# EAGLE design ESProgrammer (EAGLE 9.6.2)
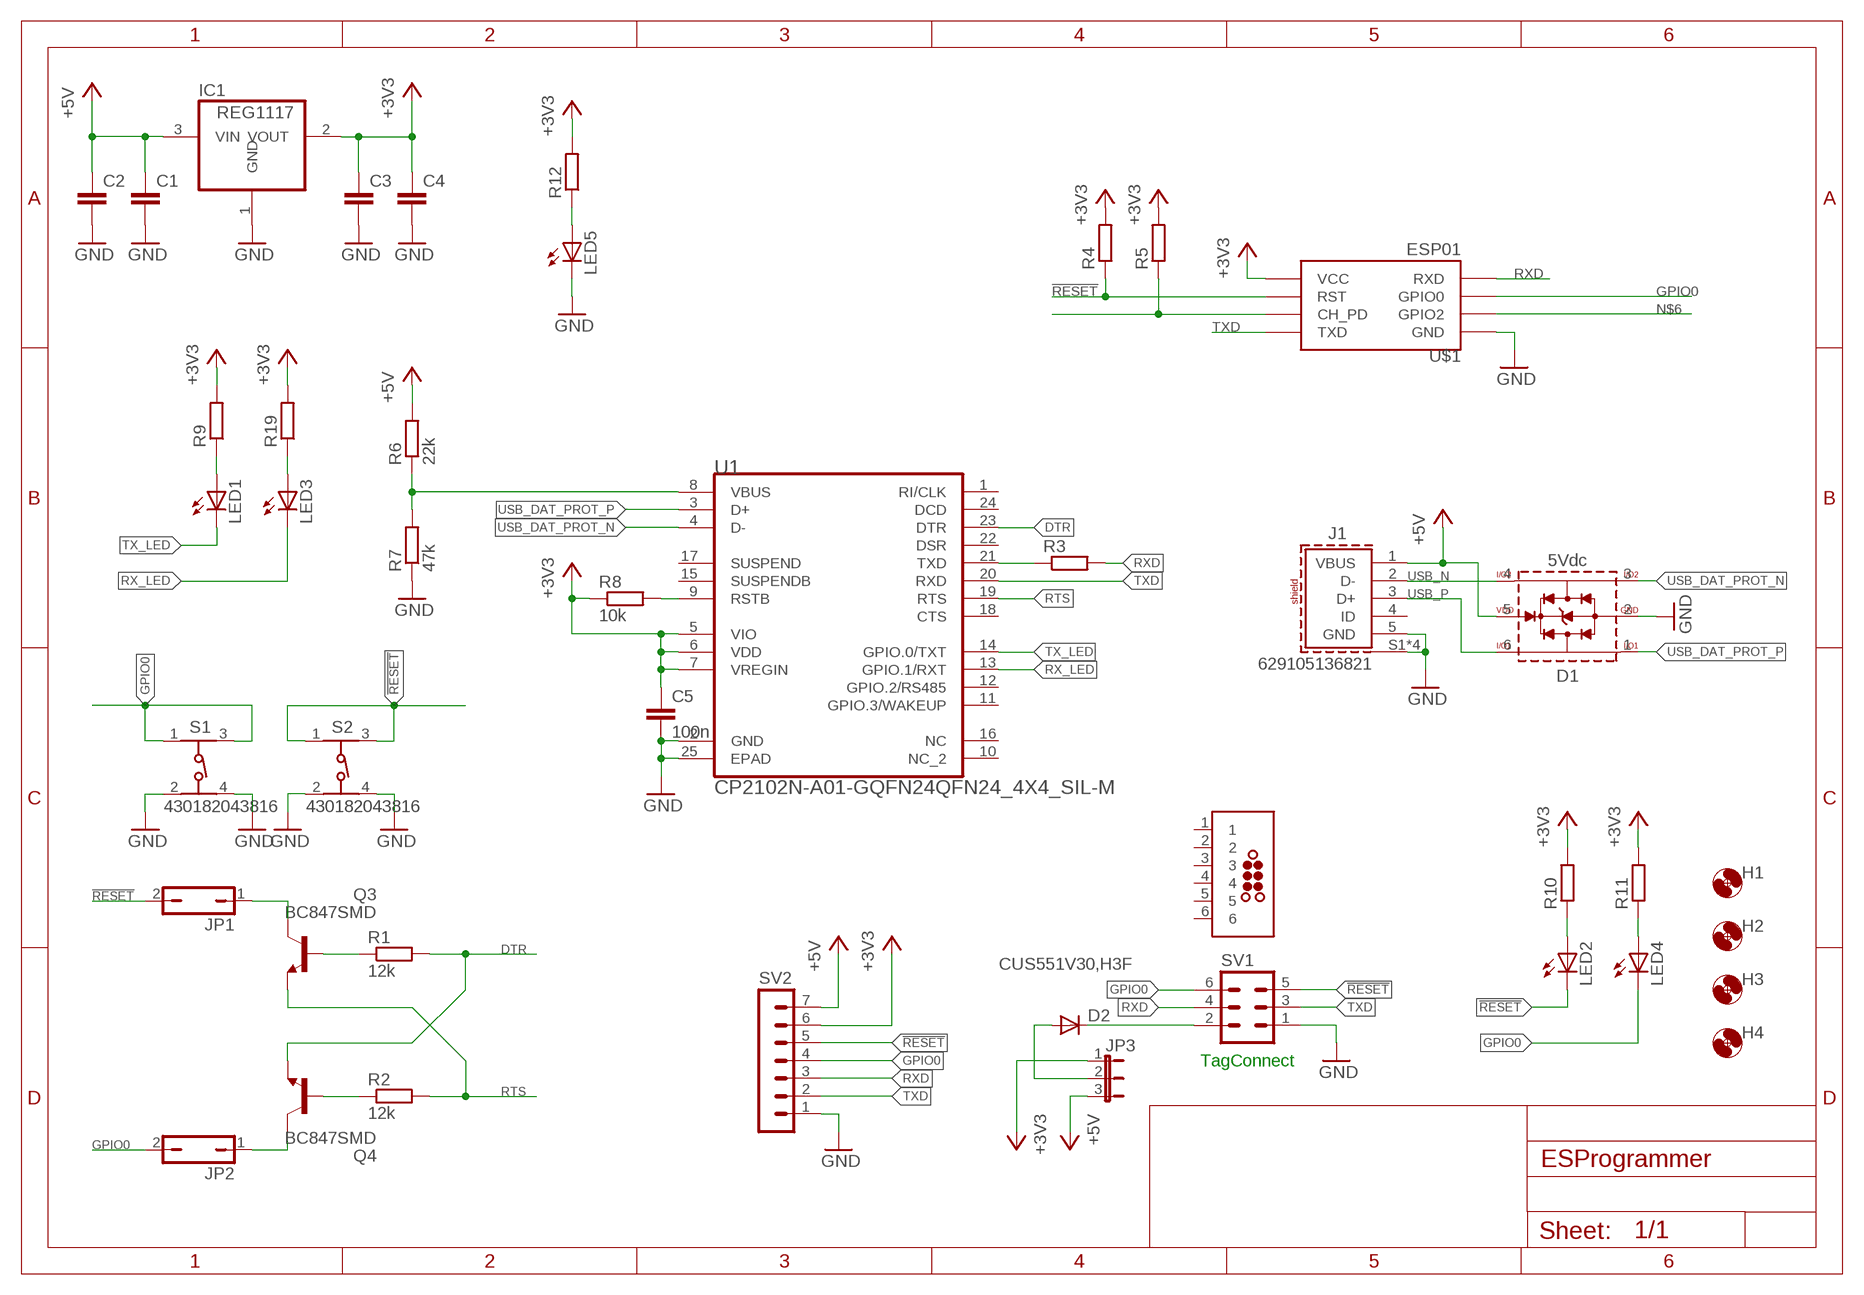
[diagram p0: schematic, sheet 1]

## Parts
C1  C-EUC0603  [C0603]
C2  C-EUC0603  [C0603]
C3  C-EUC0603  [C0603]
C4  C-EUC0603  [C0603]
C5  100n  C-EUC0603  [C0603]
D1  5Vdc  WE-TVS-HS_SOT23-6L_82400102  [WE-TVS_SOT23-6L]
D2  CUS551V30,H3F  DIODE-SOD323-R  [SOD323-R]
H1  MOUNT-HOLE3.2  [3,2]
H2  MOUNT-HOLE3.2  [3,2]
H3  MOUNT-HOLE3.2  [3,2]
H4  MOUNT-HOLE3.2  [3,2]
IC1  REG1117  [SOT223]
J1  629105136821  [629105136821]
J2  TC2030-MCP-NL  [TC2030-MCP-NL]
JP1  JP1Q  [JP1]
JP2  JP1Q  [JP1]
JP3  JP2E  [JP2]
LED1  LEDCHIP-LED0603  [CHIP-LED0603]
LED2  LEDCHIP-LED0603  [CHIP-LED0603]
LED3  LEDCHIP-LED0603  [CHIP-LED0603]
LED4  LEDCHIP-LED0603  [CHIP-LED0603]
LED5  LEDCHIP-LED0603  [CHIP-LED0603]
Q3  BC847SMD  [SOT23]
Q4  BC847SMD  [SOT23]
R1  12k  R-EU_R0603  [R0603]
R2  12k  R-EU_R0603  [R0603]
R3  R-EU_R0603  [R0603]
R4  R-EU_R0603  [R0603]
R5  R-EU_R0603  [R0603]
R6  22k  R-EU_R0603  [R0603]
R7  47k  R-EU_R0603  [R0603]
R8  10k  R-EU_R0603  [R0603]
R9  R-EU_R0603  [R0603]
R10  R-EU_R0603  [R0603]
R11  R-EU_R0603  [R0603]
R12  R-EU_R0603  [R0603]
R19  R-EU_R0603  [R0603]
S1  430182043816  [430182043816]
S2  430182043816  [430182043816]
SV1  ML6  [ML6]
SV2  MA07-1  [MA07-1]
U1  CP2102N-A01-GQFN24QFN24_4X4_SIL-M  [QFN24_4X4_SIL-M]
U$1  ESP01  [ESP01]

## Nets
!RESET: JP1.2 LED2.C R4.1 S2.1 S2.3 SV1.5 SV2.5 U$1.RST
+3V3: C3.1 C4.1 C5.1 IC1.2(VOUT) JP3.1 R4.2 R5.2 R8.1 R9.2 R10.2 R11.2 R12.2 R19.2 SV2.6 U1.5(VIO) U1.6(VDD) U1.7(VREGIN) U$1.VCC
+5V: C1.1 C2.1 D1.5(VDD) IC1.3(VIN) J1.1(VBUS) JP3.3 R6.2 SV2.7
DTR: Q4.2(E) R1.2 U1.23(DTR)
GND: C1.2 C2.2 C3.2 C4.2 C5.2 D1.2(GND) IC1.1(GND) J1.5(GND) J1.S1(SHIELD) J1.S2(SHIELD) J1.S3(SHIELD) J1.S4(SHIELD) LED5.C R7.1 S1.2 S1.4 S2.2 S2.4 SV1.1 SV2.1 U1.2(GND) U1.25(EPAD) U$1.GND
GPIO0: JP2.2 LED4.C S1.1 S1.3 SV1.6 SV2.4 U$1.GPIO0
N$1: Q3.1(B) R1.1
N$2: Q4.1(B) R2.1
N$3: JP1.1 Q3.3(C)
N$4: JP2.1 Q4.3(C)
N$5: R3.1 U1.21(TXD)
N$6: U$1.GPIO2
N$7: R5.1 U$1.CH_PD
N$8: LED1.A R9.1
N$9: LED2.A R10.1
N$10: R6.1 R7.2 U1.8(VBUS)
N$11: R8.2 U1.9(RSTB)
N$12: LED4.A R11.1
N$13: LED5.A R12.1
N$14: D2.A JP3.2
N$15: D2.C SV1.2
N$19: LED3.A R19.1
RTS: Q3.2(E) R2.2 U1.19(RTS)
RX_LED: LED3.C U1.13(GPIO.1/RXT)
RXD: R3.2 SV1.4 SV2.3 U$1.RX(RXD)
TX_LED: LED1.C U1.14(GPIO.0/TXT)
TXD: SV1.3 SV2.2 U1.20(RXD) U$1.TX(TXD)
USB_DAT_PROT_N: D1.3(I/O2) U1.4(D-)
USB_DAT_PROT_P: D1.1(I/O1) U1.3(D+)
USB_N: D1.4(I/O4) J1.2(D-)
USB_P: D1.6(I/O3) J1.3(D+)
Unconnected: J1.4(ID) J2.1 J2.4 J2.5 J2.6 U1.1(RI/CLK) U1.10(NC_2) U1.11(GPIO.3/WAKEUP) U1.12(GPIO.2/RS485) U1.15(SUSPENDB) U1.16(NC) U1.17(SUSPEND) U1.18(CTS) U1.22(DSR) U1.24(DCD)

## Notes on the sheet
- TagConnect

## Power pins joined to a net without a drawn wire
2: J2.2
3: J2.3

## Library data of the parts
C1-C5 = rcl:C-EU: CAPACITOR, European symbol
D1 = Wurth_EMC Components_WE-TVS:WE-TVS-HS_SOT23-6L_82400102: WE-TVS TVS Diode – High Speed Series Characteristics Low clamping voltage Sturdy design Very low capacitance Flow Thru Design for a simple layout Rail to Rail protection Epoxy flame resistant UL94-V0 RoHS, REACH and free of halogens Applications Very fast data lines USB 2.0 Ethernet PoE VGA Sim Cards Keypads HS = High Speed <https://www.we-online.com/catalog/media/o14883v209%20Family_WE-TVS_HIGHSPEED.jpg> Details see: https://www.we-online.com/catalog/en/WE-TVS-HS Updated by Ella Wu 2021-12-16 2021(C) Wurth Elektronik; C-CH: 2pF; CHANNELS: 2+1; DATASHEET-URL: https://www.we-online.com/catalog/datasheet/82400102.pdf; IPEAK: 7A; MOUNT: SMT; PART-NUMBER: 82400102; VBR: 6V
D2 = diode:DIODE-: DIODE
H1-H4 = holes:MOUNT-HOLE: MOUNTING HOLE with drill center marker
IC1 = burr-brown:REG1117: 800mA and 1A Low Dropout (LDO) Positive Regulator 1.8V, 2.5V, 2.85V, 3.3V, 5V, and Adj; MPN: REG1117; OC_FARNELL: 1097566; OC_NEWARK: 14P6981
J1 = Eagle_WR-USB (rev21f):629105136821: WR-COM Micro USB 2.0 SMT Type B Horizontal 5 Contacts Kind Properties Durability:10 000 Mating cycles Quality Class:10 000 Mating cycles Connector Type:Micro USB Gender:Receptacle Type:Horizontal General Information Operating Temperature:-40up to +105 °C Compliance:RoHS Electrical Properties IR 1:1A Working Voltage:30V (AC) Withstanding Voltage:100V (AC) Contact Resistance:30 mΩ Material Properties Insulator Material:LCP Insulator Flammability Rating:UL94 V-0 Color:Black Contact Material:Copper Alloy Contact Plating: Gold Contact Type:Stamped Shielding Material:Stainless Steel Shielding Plating:Nickel <https://www.we-online.com/catalog/media/o32999v209%20Family_WR-COM_629105136821.jpg> Details see: https://www.we-online.com/catalog/en/COM_MICRO_SMT_TYPE_B_HORIZONTAL/ Updated by Yingchun, Shan 2020-01-16 2020 (C) Würth Elektronik; APPLICATION: Micro USB 2.0; DATASHEET-URL: https://www.we-online.com/catalog/datasheet/629105136821.pdf; GERDER: Receptacle; INTERFACE-TYPE: Type B; IR1: 1.0A; MOUNT: SMT; PACKAGING: Tape and Reel; PART-NUMBER: 629105136821; PINS: 5; TYPE: Horizontal; WORKING-VOLTAGE: 30V(AC)
J2 = tag-connect:TC2030: TAG-CONNECT ICSP Connector Manufacturer: Tag-Connect <http://www.tag-connect.com> Cable for easy In-Circuit Serial Programming. Designed for Microchip ICD2, suitable for many others. Two variants - one "with legs" (for hands-free fit on PCB) and another "without legs" for quick programming. PAD Description 1 MCLR/Vpp 2 Vdd 3 GND 4 PGD (ISPDAT) 5 PGC (ISPCLK) 6 nc (used for LVP) ©2009 ROFA.cz - modified and updated by Robert Darlington ‹rdarlington@gmail.com›
JP1 JP2 = jumper:JP1Q: JUMPER
JP3 = jumper:JP2E: JUMPER
LED1-LED5 = led:LED: LED OSRAM: - CHIPLED LG R971, LG N971, LY N971, LG Q971, LY Q971, LO R971, LY R971 LH N974, LH R974 LS Q976, LO Q976, LY Q976 LO Q996 - Hyper CHIPLED LW Q18S LB Q993, LB Q99A, LB R99A - SideLED LS A670, LO A670, LY A670, LG A670, LP A670 LB A673, LV A673, LT A673, LW A673 LH A674 LY A675 LS A676, LA A676, LO A676, LY A676, LW A676 LS A679, LY A679, LG A679 - Hyper Micro SIDELED® LS Y876, LA Y876, LO Y876, LY Y876 LT Y87S - SmartLED LW L88C, LW L88S LB L89C, LB L89S, LG L890 LS L89K, LO L89K, LY L89K LS L896, LA L896, LO L896, LY L896 - TOPLED LS T670, LO T670, LY T670, LG T670, LP T670 LSG T670, LSP T670, LSY T670, LOP T670, LYG T670 LG T671, LOG T671, LSG T671 LB T673, LV T673, LT T673, LW T673 LH T674 LS T676, LA T676, LO T676, LY T676, LB T676, LH T676, LSB T676, LW T676 LB T67C, LV T67C, LT T67C, LS T67K, LO T67K, LY T67K, LW E67C LS E67B, LA E67B, LO E67B, LY E67B, LB E67C, LV E67C, LT E67C LW T67C LS T679, LY T679, LG T679 LS T770, LO T770, LY T770, LG T770, LP T770 LB T773, LV T773, LT T773, LW T773 LH T774 LS E675, LA E675, LY E675, LS T675 LS T776, LA T776, LO T776, LY T776, LB T776 LHGB T686 LT T68C, LB T68C - Hyper Mini TOPLED® LB M676 - Mini TOPLED Santana® LG M470 LS M47K, LO M47K, LY M47K Source: http://www.osram.convergy.de LUXEON: - LUMILED® LXK2-PW12-R00, LXK2-PW12-S00, LXK2-PW14-U00, LXK2-PW14-V00 LXK2-PM12-R00, LXK2-PM12-S00, LXK2-PM14-U00 LXK2-PE12-Q00, LXK2-PE12-R00, LXK2-PE12-S00, LXK2-PE14-T00, LXK2-PE14-U00 LXK2-PB12-K00, LXK2-PB12-L00, LXK2-PB12-M00, LXK2-PB14-N00, LXK2-PB14-P00, LXK2-PB14-Q00 LXK2-PR12-L00, LXK2-PR12-M00, LXK2-PR14-Q00, LXK2-PR14-R00 LXK2-PD12-Q00, LXK2-PD12-R00, LXK2-PD12-S00 LXK2-PH12-R00, LXK2-PH12-S00 LXK2-PL12-P00, LXK2-PL12-Q00, LXK2-PL12-R00 Source: www.luxeon.com KINGBRIGHT: KA-3528ASYC Source: www.kingbright.com
Q3 Q4 = transistor-npn:BC847*: NPN Transistor
R1-R12 R19 = rcl:R-EU_: RESISTOR, European symbol
S1 S2 = Wurth_Switch_WS-TASV:430182043816: WS-TASV SMT Tact Switch 6x6 mm Material Properties Cover Material : Stainless Steel Properties Actuator Material:LCP Actuator Flammability :UL94 V-0 Rating Actuator Color:Black; Salmon; White Frame Material:LCP Flammability Rating:UL94 V-0 Frame Color:Black Contact Material:Stainless Steel Contact Plating:Silver Terminal Material:Copper Alloy Terminal Plating:Silver VR:12 V (DC) Contact Resistance Initial:100 mΩ Contact Resistance After Life Test:2Ω RISO:100 MΩ Withstanding Voltage:250 V (AC) Washable:No Qty.:4000;5000 Mechanical Properties Electrical Life:400; 550; 1000 Stroke :0.25 mm General Information Operating Temperature:-40 up to +85 °C Washable:No Packaging Properties Packaging:Tape and Reel <https://www.we-online.com/catalog/media/o37470v209%20Family_WS-TASV_6x6mm_SMD_Tact_Switch_4301820xx8xx.jpg> Details see: https://www.we-online.com/catalog/en/TASV_6X6_SMD/ Updated by yingchun,Shan;2020-02-18 2020(C) Würth Elektronik; DATASHEET-URL: https://www.we-online.com/catalog/datasheet/430182043816.pdf; H: 4.3mm; OPERATION-FORCE: 160g; PART-NUMBER: 430182043816; QTY: 1000
SV1 = con-harting-ml:ML6: HARTING; OC_FARNELL: unknown; OC_NEWARK: unknown
SV2 = con-lstb:MA07-1: PIN HEADER; OC_FARNELL: unknown; OC_NEWARK: unknown
U1 = Eigene-Rietig:CP2102N-A01-GQFN24; COPYRIGHT: Copyright (C) 2021 Ultra Librarian. All rights reserved.; MANUFACTURER_PART_NUMBER: CP2102N-A01-GQFN24; MFR_NAME: Silicon Labs
U$1 = esp8266modules:ESP01: ESP8266 Wifi module 01

## Board
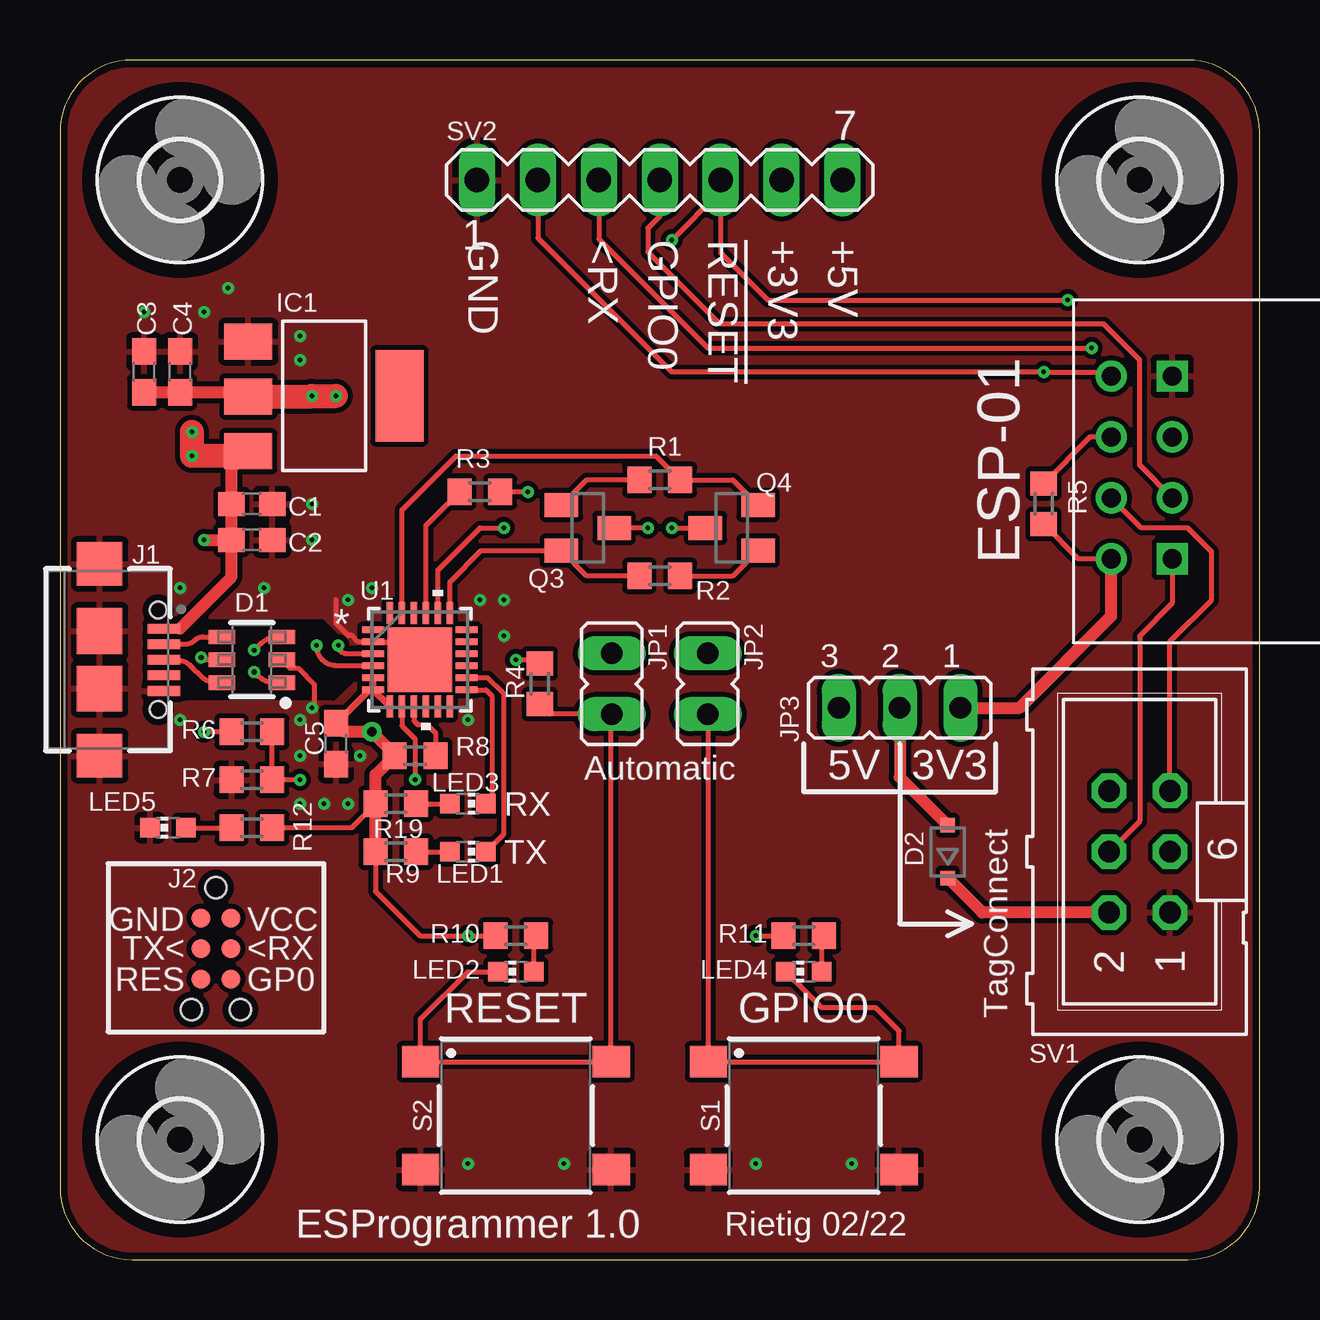
[diagram p1: board, top side]
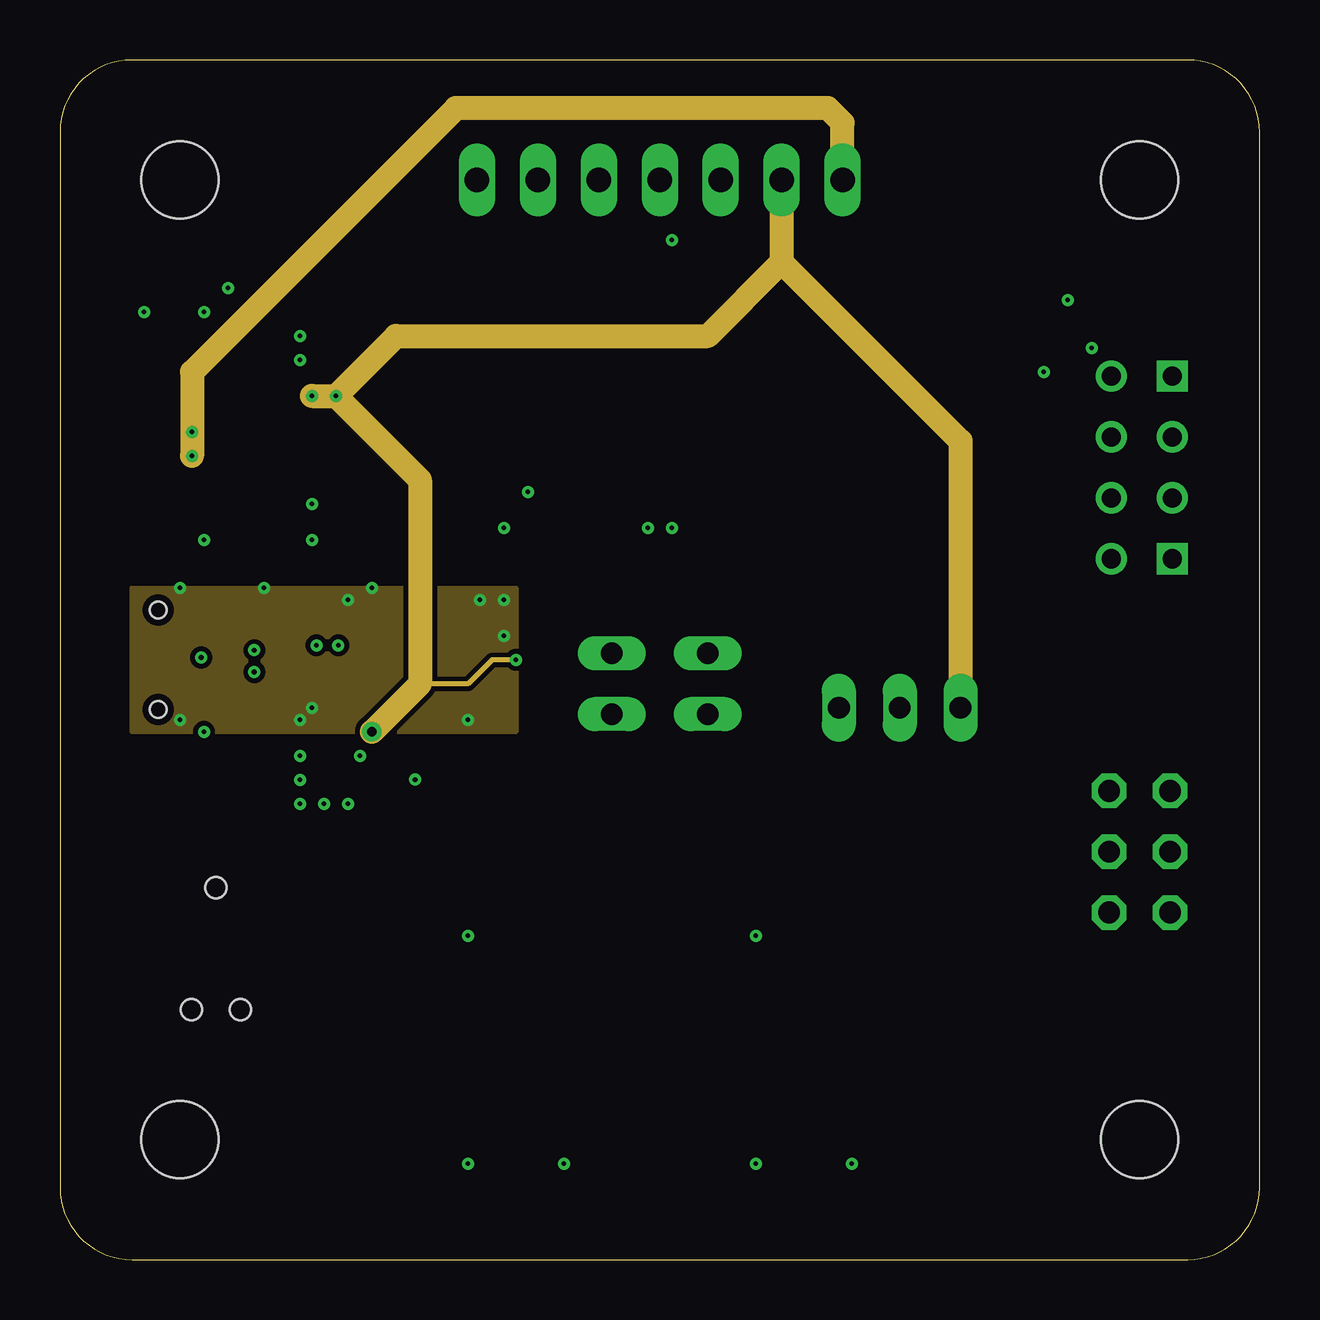
[diagram p2: board, inner layer Route2]
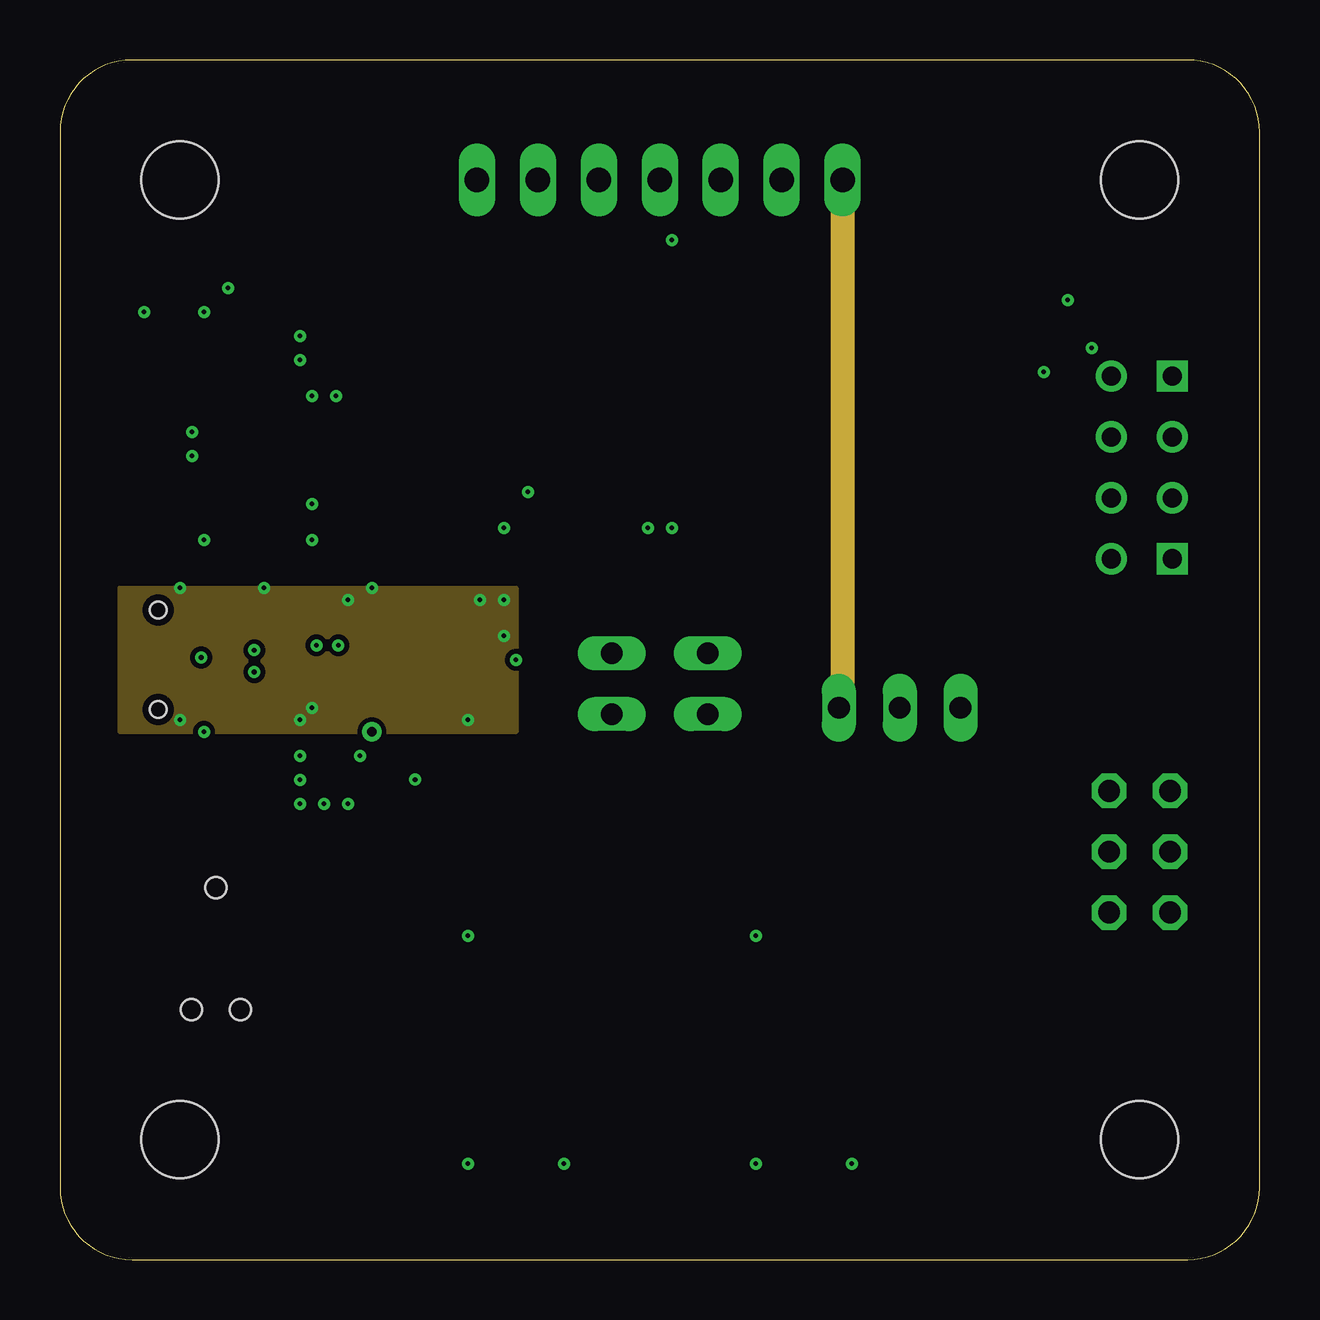
[diagram p3: board, inner layer Route15]
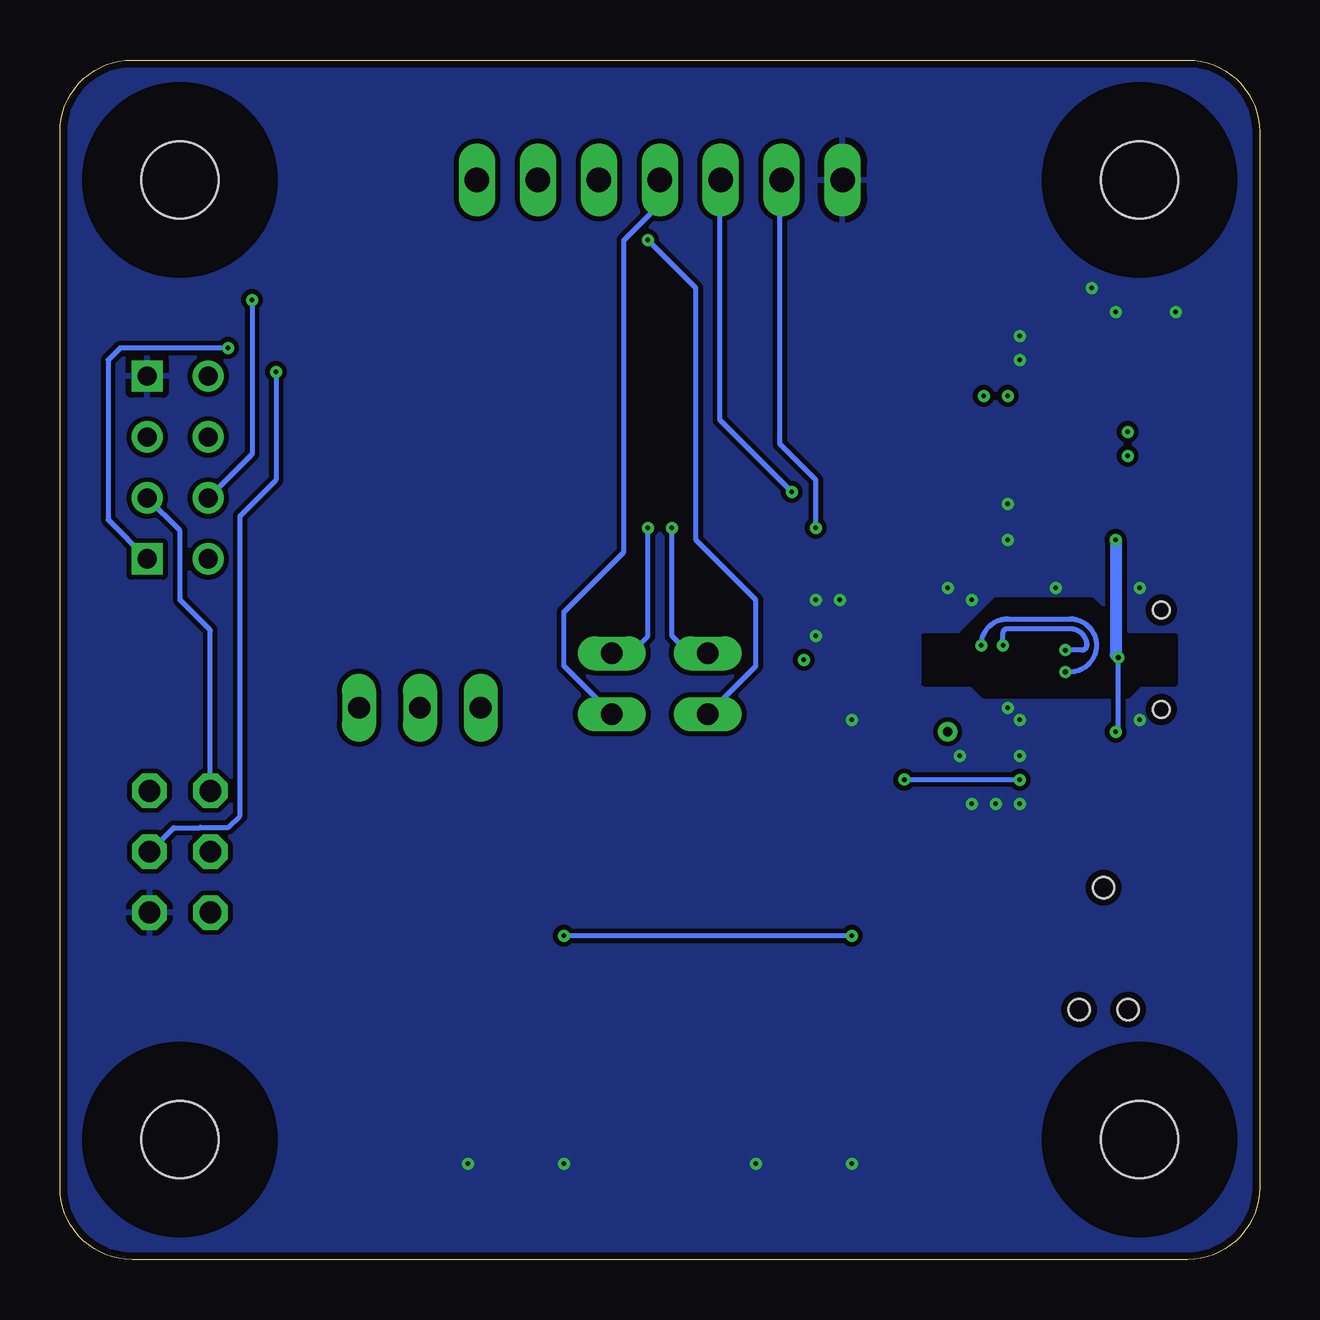
[diagram p4: board, bottom side, seen from below]

Size 50 x 50 mm. Coordinates in mm from the lower left corner, seen from the top.
Outline: 0,47 0,3 arc90 3,0 47,0 arc90 50,3 50,47 arc90 47,50 3,50 arc90 0,47
Copper layers (1+2*15+16): Top 0.035mm / dielectric 0.2mm / Route2 0.0175mm / dielectric 1.065mm / Route15 0.0175mm / dielectric 0.2mm / Bottom 0.035mm
Design rules "jlcpcb-4layers_seb *": minimum track width 0.2mm, minimum drill 0.2mm, track to track 8mil, track to pad 8mil, pad to pad 8mil, via to via 8mil, smd to smd 8mil, copper to edge 0.3mm, drill to drill 8mil, minimum pad ring 10mil, minimum via ring 0.15mm, stop-mask expansion 2mil, vias tented up to drill 20mil, thermal gap 10mil

### Footprints (pad centres in the part's own frame; a part is rotated, then mirrored left to right if it is on the bottom)
C0603 = smd 1.1 x 1: 1 -0.85,0; 2 0.85,0
WE-TVS_SOT23-6L = smd 0.6 x 1.1: 1 -0.95,-1.25; 2 0,-1.25; 3 0.95,-1.25; 4 0.95,1.25; 5 0,1.25; 6 -0.95,1.25
SOD323-R = smd 0.6 x 0.6: A 1.1,0; C -1.1,0
3,2 = hole 3.2: 0,0
SOT223 = smd 1.499 x 2.007: 1 -2.261,-3.15; 2 0.025,-3.15; 3 2.311,-3.15 | smd 3.81 x 2.007: 4 0,3.15
629105136821 = smd 0.4 x 1.35: 1 -1.3,2.325; 2 -0.65,2.325; 3 0,2.325; 4 0.65,2.325; 5 1.3,2.325 | smd 1.8 x 1.9: S1 -4,-0.35; S4 4,-0.35 | smd 1.9 x 1.9: S2 -1.2,-0.35; S3 1.2,-0.35 | hole 0.7: -2.075,2.1; 2.075,2.1
TC2030-MCP-NL = smd 0.787 x 0.787: 1 1.27,-0.635; 2 1.27,0.635; 3 2.54,-0.635; 4 2.54,0.635; 5 3.81,-0.635; 6 3.81,0.635 | hole 0.889: 0,0; 5.08,-1.016; 5.08,1.016
JP1 = drill 0.914 long: 1 0,-1.27; 2 0,1.27
JP2 = drill 0.914 long: 1 -2.54,0; 2 0,0; 3 2.54,0
CHIP-LED0603 = smd 0.8 x 0.8: A 0,-0.75; C 0,0.75
SOT23 = smd 1 x 1.4: 1 -0.95,-1.1; 2 0.95,-1.1; 3 0,1.1
R0603 = smd 1 x 1.1: 1 -0.85,0; 2 0.85,0
430182043816 = smd 1.55 x 1.3: 1 -3.975,2.25; 2 -3.975,-2.25; 3 3.975,2.25; 4 3.975,-2.25
ML6 = drill 0.914 octagon: 1 -2.54,-1.27; 2 -2.54,1.27; 3 0,-1.27; 4 0,1.27; 5 2.54,-1.27; 6 2.54,1.27
MA07-1 = drill 1.016 long: 1 -7.62,0; 2 -5.08,0; 3 -2.54,0; 4 0,0; 5 2.54,0; 6 5.08,0; 7 7.62,0
QFN24_4X4_SIL-M = smd 0.914 x 0.254: 1 -1.943,1.25; 2 -1.943,0.75; 3 -1.943,0.25; 4 -1.943,-0.25; 5 -1.943,-0.75; 6 -1.943,-1.25; 13 1.943,-1.25; 14 1.943,-0.75; 15 1.943,-0.25; 16 1.943,0.25; 17 1.943,0.75; 18 1.943,1.25 | smd 0.254 x 0.914: 7 -1.25,-1.943; 8 -0.75,-1.943; 9 -0.25,-1.943; 10 0.25,-1.943; 11 0.75,-1.943; 12 1.25,-1.943; 19 1.25,1.943; 20 0.75,1.943; 21 0.25,1.943; 22 -0.25,1.943; 23 -0.75,1.943; 24 -1.25,1.943 | smd 2.692 x 2.692: 25 0,0
ESP01 = drill 0.8: CH_PD -1.285,-8.178; GPIO0 1.255,-5.638; GPIO2 -1.285,-5.638; RST 1.255,-8.178; TX -3.825,-8.178; VCC 3.795,-8.178 | drill 0.8 square: GND -3.825,-5.638; RX 3.795,-5.638

### Placement (x,y rotation side)
C1  8,31.5 0 top
C2  8,30 0 top
C3  3.5,37 90 top
C4  5,37 90 top
C5  11.5,21.5 270 top
D1  8,25 90 top
D2  37,17 90 top
H1  5,5 0 top
H2  45,5 0 top
H3  45,45 0 top
H4  5,45 0 top
IC1  11,36 270 top
J1  2,25 270 top
J2  6.5,15.5 270 top
JP1  23,24 180 top
JP2  27,24 180 top
JP3  35,23 180 top
LED1  17,17 270 top
LED2  19,12 90 top
LED3  17,19 270 top
LED4  31,12 90 top
LED5  4.5,18 90 top
Q3  22,30.5 270 top
Q4  28,30.5 90 top
R1  25,32.5 0 top
R2  25,28.5 180 top
R3  17.5,32 0 top
R4  20,24 90 top
R5  41,31.5 270 top
R6  8,22 180 top
R7  8,20 0 top
R8  14.8,21 0 top
R9  14,17 180 top
R10  19,13.5 180 top
R11  31,13.5 180 top
R12  8,18 0 top
R19  14,19 180 top
S1  31,6 0 top
S2  19,6 0 top
SV1  45,17 90 top
SV2  25,45 0 top
U1  15,25 0 top
U$1  52,33 270 top

### Tracks (layer width: path | path; a pad name or v marks a point on that pad's centre or on a via)
!RESET  (via drill 0.2 pad 0.4)
  Top 0.2: R4.1 20.42,22.73 JP1.2 22.98,22.7 S2.3 S2.1 15.03,10.03 17,12 LED2.C | v25.5,42.5 27.54,44.54 SV2.5 27.54,41.96 29.5,40 v42,40 | SV1.5 46.27,25.77 48,27.5 48,29.5 47,30.5 45.07,30.5 U$1.RST
  Bottom 0.2: JP1.2 21,24.73 21,27.5 23.5,30 23.5,40.5 v25.5,42.5 | v42,40 42,33.57 U$1.RST
+3V3  (via drill 0.2 pad 0.4, 0.2 pad 0.5, 0.4 pad 0.8)
  Top 0.2: U$1.VCC 42.45,29.2 R5.2 | R9.2 13.15,15.35 15,13.5 v17,13.5 R10.2 | v29,13.5 R11.2 | R4.2 19.85,25 v19,25 | R12.2 12.15,18 R19.2
  Top 0.3: C5.1 12.9,23.75 U1.6 | U1.6 U1.5 | U1.7 U1.6
  Top 0.5: C3.1 C4.1 7.67,36.15 IC1.2 | JP3.1 40,23 43.82,26.82 U$1.VCC | C5.1 11.85,22 v13,22 13.95,21.05 R8.1 13.15,20.2 R19.2 R9.2
  Top 1: IC1.2 10.47,35.98 v10.5,36 v11.5,36
  Route2 0.2: v19,25 18,25 17,24 15,24
  Route2 1: v11.5,36 14,38.5 27,38.5 30.08,41.58 | SV2.6 30.08,41.58 | 30.08,41.58 37.54,34.12 JP3.1 | v11.5,36 15,32.5 15,24 v13,22 | v10.5,36 v11.5,36
  Bottom 0.2: v17,13.5 v29,13.5
+5V  (via drill 0.2 pad 0.5)
  Top 0.2: D1.5 5.98,25 v5.89,25.1 | R6.2 v6,22 | J1.1 5,26.3
  Top 0.5: C2.1 7.15,28.45 5,26.3 | C2.1 C1.1 7.15,32.99 IC1.3 | v6,30 C2.1
  Top 1: IC1.3 7.66,33.5 v5.5,33.5 v5.5,34.5
  Route2 1: SV2.7 32.62,47.38 32,48 16.5,48 5.5,37 v5.5,33.5
  Route15 1: SV2.7 32.62,23.16 JP3.3
  Bottom 0.2: v6,22 5.89,22.11 v5.89,25.1
  Bottom 0.5: v6,30 6,25.21 v5.89,25.1
DTR
  Top 0.2: Q4.2 28.05,32.5 R1.2 24.85,33.5 16.5,33.5 14.25,31.25 U1.23
GND  (via drill 0.2 pad 0.5)
  Top 0.2: U1.25 14.25,25.75 U1.2 12.43,25.75 12.18,26 12,26 11.5,26.5 11.5,27.5 | D1.2 9.6,24.65 9.93,24.65 10.6,23.98 10.6,23.1 v10.5,23
  other vias: 13,28 8.5,28 5,28 5,22.5 10,22.5 12,27.5 17.5,27.5 17,22.5 18.5,27.5 10.5,31.5 10.5,30 10,38.5 10,37.5 7,40.5 6,39.5 3.5,39.5 17,4 21,4 29,4 33,4 10,21 12.5,21 11,19 10,19 12,19 18.5,26
  pour Bottom: 47,0 3,0 arc-90 0,3 0,47 arc-90 3,50 47,50 arc-90 50,47 50,3 arc-90
  pour Top: 47,0 3,0 arc-90 0,3 0,47 arc-90 3,50 47,50 arc-90 50,47 50,3 arc-90
  cutout Top (isolate 0.8, no thermals): 13.3,24.5 12.5,24.5 11.4,23.4 5.3,23.4 4.3,24.4 4.3,25.6 5.3,26.6 10.9,26.6 12,25.5 13.3,25.5
  pour Route2: 3,28 19,28 19,22 3,22
  pour Route15: 3,28 19,28 19,22 3,22
  cutout Bottom: 3.5,26 5.5,26 6.5,27 7,27.5 11,27.5 12.5,26 14,26 14,24 12,24 11.5,23.5 5.5,23.5 5,24 3.5,24
  pour Route15: 2.5,28 17.5,28 17.5,22 2.5,22
GPIO0
  Top 0.2: JP2.2 27.02,22.7 S1.1 S1.3 34.98,9.53 34,10.5 31.75,10.5 LED4.C | SV2.4 25,43.5 24.5,43 24.5,42 27.5,39 43.5,39 45,37.5 45,33.11 U$1.GPIO0
  Bottom 0.2: JP2.2 29,24.73 29,27 26.5,29.5 26.5,42.5 25,44 SV2.4 | SV1.6 43.73,26.23 45,27.5 45,30.38 U$1.GPIO0
N$1
  Top 0.2: R1.1 21.95,32.5 Q3.1
N$2
  Top 0.2: R2.1 28.05,28.5 Q4.1
N$3  (via drill 0.2 pad 0.4)
  Top 0.2: v24.5,30.5 Q3.3
  Bottom 0.2: JP1.1 23.77,25.27 24.5,26 v24.5,30.5
N$4  (via drill 0.2 pad 0.5)
  Top 0.2: v25.5,30.5 Q4.3
  Bottom 0.2: JP2.1 26.23,25.27 25.5,26 v25.5,30.5
N$5
  Top 0.2: U1.21 15.25,30.6 R3.1
N$7
  Top 0.2: U$1.CH_PD 42.94,34.28 R5.1
N$8
  Top 0.2: R9.1 LED1.A
N$9
  Top 0.2: LED2.A 19.75,13.4 R10.1
N$10  (via drill 0.2 pad 0.5)
  Top 0.2: v10,20 R7.2 R6.1 | U1.8 14.25,22.25 14.8,21.7 v14.8,20
  Bottom 0.2: v14.8,20 v10,20
N$11
  Top 0.2: U1.9 14.75,22.45 14.9,22.3 15.3,22.3 15.65,21.95 R8.2
N$12
  Top 0.2: LED4.A 31.75,13.4 R11.1
N$13
  Top 0.2: LED5.A 7.11,18 7.13,17.98 R12.1
N$14
  Top 0.5: JP3.2 35,20.1 D2.A
N$15
  Top 0.5: SV1.2 38.44,14.46 D2.C
N$19
  Top 0.2: R19.1 LED3.A
RTS
  Top 0.2: R2.2 21.95,28.5 Q3.2 17.55,29.55 16.25,28.25 U1.19
RX_LED
  Top 0.2: U1.13 17.75,23.75 18,23.5 18,19.25 LED3.C
RXD  (via drill 0.2 pad 0.4)
  Top 0.2: v19.5,32 R3.2 | SV2.3 22.46,42.54 27,38 v43,38 | U$1.RX 46.36,27.36 45,26 45,18.27 SV1.4
  Bottom 0.2: v19.5,32 22.5,35 22.5,44.96 SV2.3 | v43,38 47.5,38 48,37.5 48,30.84 U$1.RX
TX_LED
  Top 0.2: U1.14 17.82,24.25 18.5,23.57 18.5,17.75 LED1.C
TXD  (via drill 0.2 pad 0.5)
  Top 0.2: U1.20 15.75,28.75 17.5,30.5 v18.5,30.5 | SV2.2 19.92,42.58 25.5,37 v41,37 43.65,37 U$1.TX
  Bottom 0.2: v18.5,30.5 18.5,32.5 20,34 20,44.92 SV2.2 | SV1.3 45.27,18 44.16,18 44.15,18.01 42.99,18.01 42.5,18.5 42.5,31 41,32.5 v41,37
USB_DAT_PROT_N  (via drill 0.2 pad 0.5)
  Top 0.2: v10.69,25.6 arc90 11.54,24.75 U1.4 | D1.3 9.06,25.95 arc45 8.36,25.66 v8.1,25.4
  Bottom 0.2: v10.69,25.6 10.69,26.11 arc90 10.5,26.3 7.9,26.3 arc90 7.2,25.6 arc90 7.4,25.4 v8.1,25.4
USB_DAT_PROT_P  (via drill 0.2 pad 0.5)
  Top 0.2: v11.6,25.6 arc90 11.95,25.25 U1.3 | v8.1,24.49 8.25,24.34 arc45 8.96,24.05 D1.1
  Bottom 0.2: v11.6,25.6 v11.6,25.6 arc90 10.5,26.7 7.9,26.7 arc90 6.8,25.6 arc90 7.91,24.49 v8.1,24.49
USB_N
  Top 0.2: J1.2 5.24,25.65 arc45 5.6,25.8 arc-45 5.96,25.95 D1.4
USB_P
  Top 0.2: J1.3 4.79,25 arc-45 5.49,24.71 5.9,24.3 arc45 6.5,24.05 D1.6

### Text on the board
tPlace: GND | <RX | GPIO0 | !RESET | +3V3 | +5V | ESP-01 | Automatic | 5V | 3V3 | RX | TX | GND | VCC | TagConnect | TX< | <RX | RES | GP0 | RESET | GPIO0 | ESProgrammer 1.0 | Rietig 02/22